# EAGLE design ArduWatch (EAGLE 6.4)
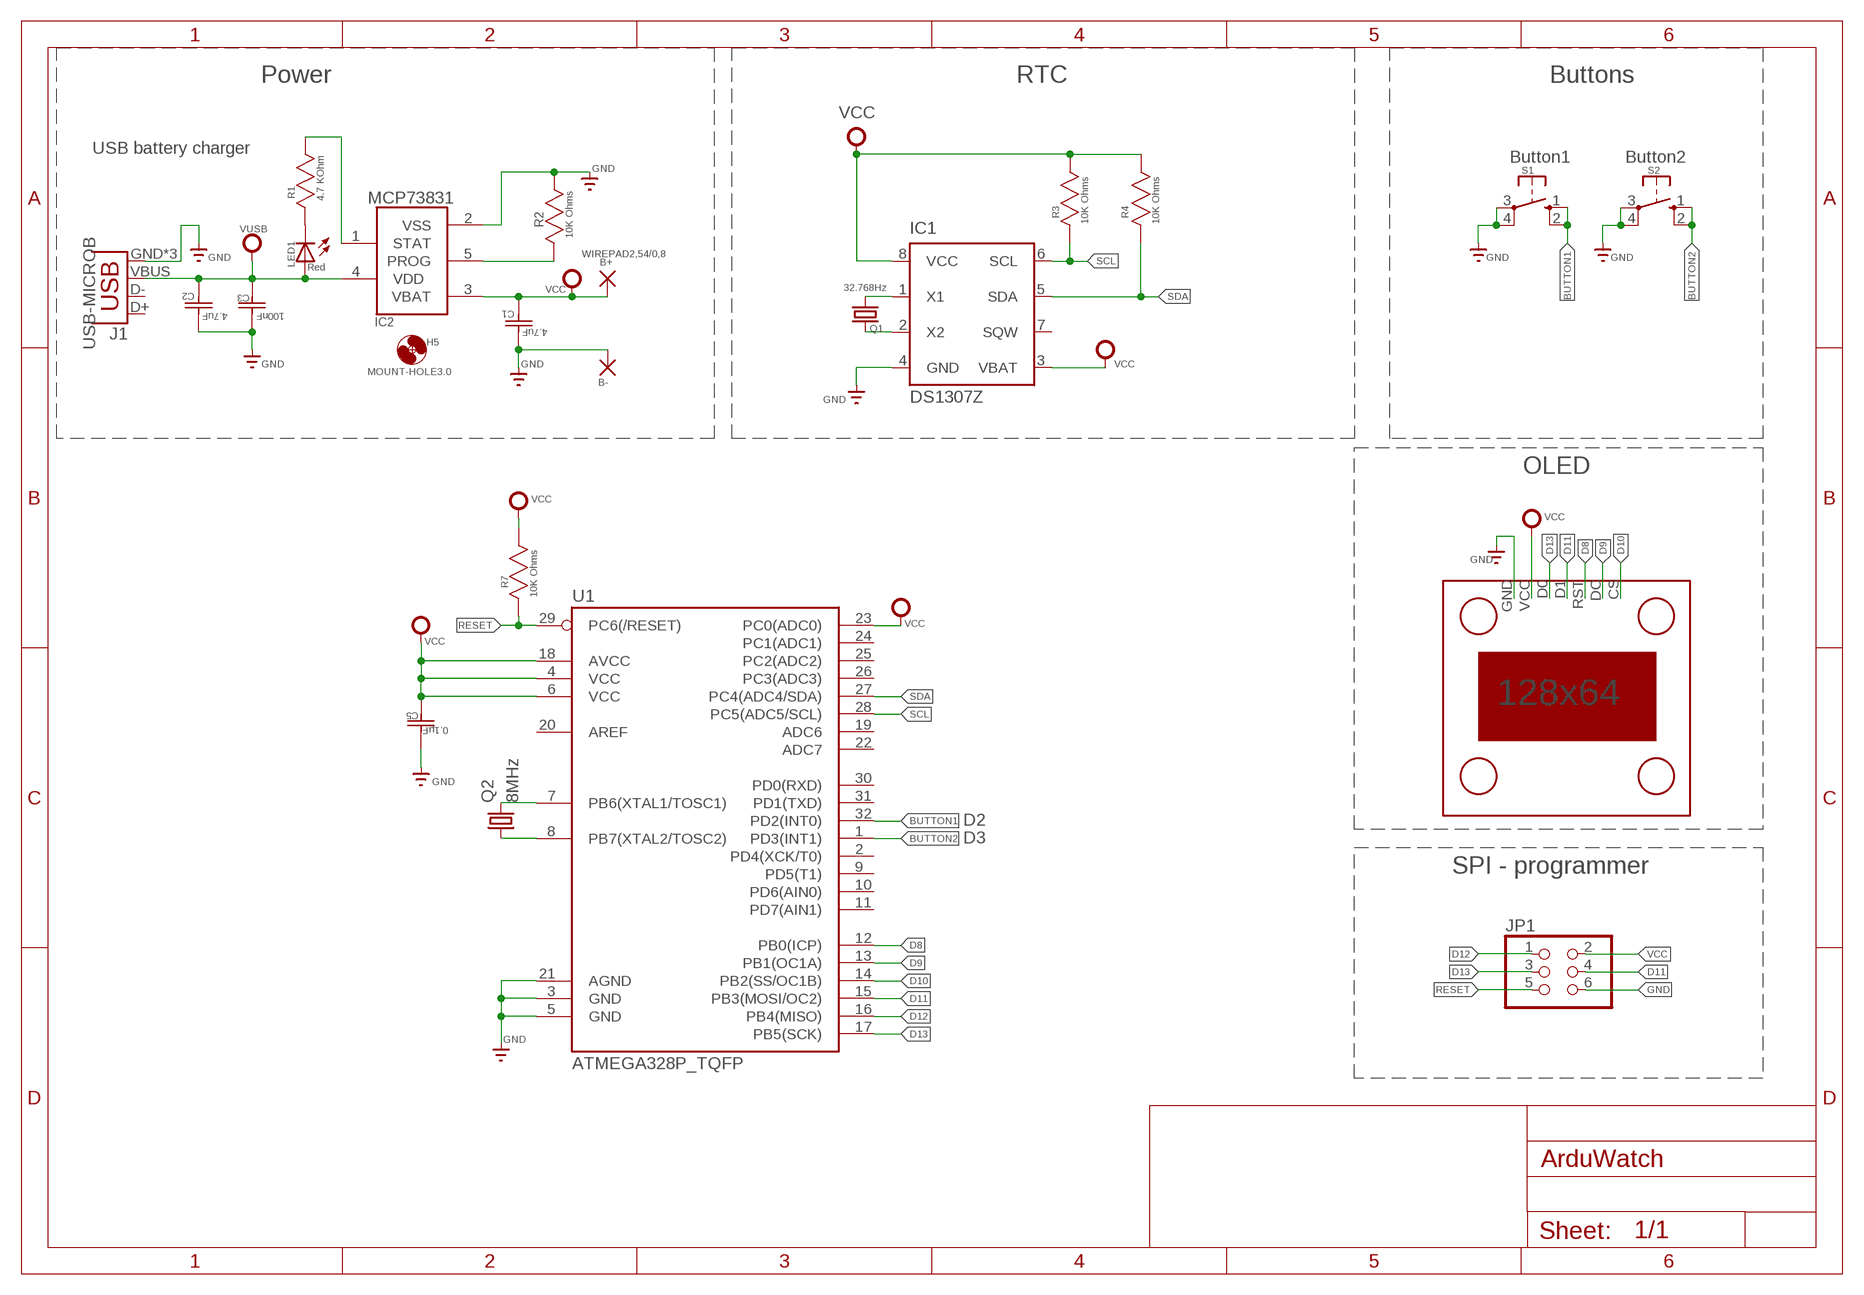
[diagram p0: schematic, sheet 1]

## Parts
1,3"OLED1  OLED  [1,3"OLED]
B+  WIREPAD2,54/0,8  [2,54/0,8]
B-  WIREPAD2,54/0,8  [2,54/0,8]
C1  4.7uF  C1206C475K3RACTU  [CAPC3216X180N]
C2  4.7uF  C1206C475K3RACTU  [CAPC3216X180N]
C3  100nF  C1206C104K1RACTU  [CAPC3216X88N]
C5  0.1µF  1206YC104KAT2A  [CAPC3216X94N]
H5  MOUNT-HOLE3.0  [3,0]
IC1  DS1307Z  [SOIC8]
IC2  MCP73831  [SOT23-5L]
J1  USB-MICROB  [USB-MICROB]
JP1  PINHD-2X3  [2X03]
LED1  Red  LEDCHIPLED_1206  [CHIPLED_1206]
Q1  32.768Hz  CRYSTALTC26H  [TC26H]
Q2  8MHz  CRYSTALHC49S  [HC49/S]
R1  4.7 KOhm  ERJ-8ENF4701V  [RESC3216X71N]
R2  10K Ohms  MC0.125W12061%10K  [RESC3216X71N]
R3  10K Ohms  MC0.125W12061%10K  [RESC3216X71N]
R4  10K Ohms  MC0.125W12061%10K  [RESC3216X71N]
R7  10K Ohms  MC0.125W12061%10K  [RESC3216X71N]
S1  Button1  10-XX  [B3F-10XX]
S2  Button2  10-XX  [B3F-10XX]
U1  ATMEGA328P_TQFP  [TQFP32-08]

## Nets
BUTTON1: S1.1(S) S1.2(S1) U1.32(PD2(INT0))
BUTTON2: S2.1(S) S2.2(S1) U1.1(PD3(INT1))
D8: 1,3"OLED1.RST U1.12(PB0(ICP))
D9: 1,3"OLED1.DC U1.13(PB1(OC1A))
D10: 1,3"OLED1.CS U1.14(PB2(SS/OC1B))
D11: 1,3"OLED1.D1 JP1.4 U1.15(PB3(MOSI/OC2))
D12: JP1.1 U1.16(PB4(MISO))
D13: 1,3"OLED1.D0 JP1.3 U1.17(PB5(SCK))
GND: 1,3"OLED1.GND B-.1(P) C1.1(C1) C2.1(C1) C3.1(C1) C5.1(C1) IC1.4(GND) IC2.2(VSS) J1.GND J1.MT1(GND) J1.MT2(GND) JP1.6 R2.1(R1) S1.3(P) S1.4(P1) S2.3(P) S2.4(P1) U1.3(GND) U1.5(GND) U1.21(AGND)
N$1: LED1.C R1.2(R2)
N$2: IC1.1(X1) Q1.2
N$3: IC2.1(STAT) R1.1(R1)
N$4: IC2.5(PROG) R2.2(R2)
N$5: IC1.2(X2) Q1.1
N$8: Q2.2 U1.7(PB6(XTAL1/TOSC1))
N$9: Q2.1 U1.8(PB7(XTAL2/TOSC2))
RESET: JP1.5 R7.2(R2) U1.29(PC6(/RESET))
SCL: IC1.6(SCL) R3.2(R2) U1.28(PC5(ADC5/SCL))
SDA: IC1.5(SDA) R4.2(R2) U1.27(PC4(ADC4/SDA))
VCC: 1,3"OLED1.VCC B+.1(P) C1.2(C2) C5.2(C2) IC1.3(VBAT) IC1.8(VCC) IC2.3(VBAT) JP1.2 R3.1(R1) R4.1(R1) R7.1(R1) U1.4(VCC) U1.6(VCC) U1.18(AVCC) U1.23(PC0(ADC0))
VUSB: C2.2(C2) C3.2(C2) IC2.4(VDD) J1.VBUS LED1.A
Unconnected: IC1.7(SQW) J1.D+ J1.D- U1.2(PD4(XCK/T0)) U1.9(PD5(T1)) U1.10(PD6(AIN0)) U1.11(PD7(AIN1)) U1.19(ADC6) U1.20(AREF) U1.22(ADC7) U1.24(PC1(ADC1)) U1.25(PC2(ADC2)) U1.26(PC3(ADC3)) U1.30(PD0(RXD)) U1.31(PD1(TXD))

## Notes on the sheet
- Power | RTC | Buttons
- USB battery charger
- OLED
- D2
- D3
- SPI - programmer

## Library data of the parts
1,3"OLED1 = Podreczne:OLED
B+ B- = wirepad:WIREPAD: Wire PAD connect wire on PCB
C1 C2 = Kemet_By_element14_Batch_1:C1206C475K3RACTU: CAPACITOR, 1206; MPN: C1206C475K3RACTU; OC_FARNELL: 1288211; OC_NEWARK: 88K0224; SUPPLIER: Kemet; TOLERANCE: ±10%; VOLTAGERATING: 25V
C3 = Kemet_By_element14_Batch_1:C1206C104K1RACTU: CAPACITOR, 1206; MPN: C1206C104K1RACTU; OC_FARNELL: 1414714; OC_NEWARK: 85C2205; SUPPLIER: Kemet; TOLERANCE: ±10%; VOLTAGERATING: 100V
C5 = AVX_By_element14_Batch_1:1206YC104KAT2A: Capacitor 1206; MPN: 1206YC104KAT2A; OC_FARNELL: 4705907; OC_NEWARK: 34C6813; SUPPLIER: AVX; TOLERANCE: ±10%; VOLTAGERATING: 16V
H5 = holes:MOUNT-HOLE: MOUNTING HOLE with drill center marker
IC1 = ds1307_pcf8583:DS1307: I2C-Bus CLOCK/CALENDAR
IC2 = microchip-update:MCP73831: Miniature Single-Cell, Fully Integrated Li-Ion, Li-Polymer Charge Management Controllers
J1 = SparkFun-Connectors:USB: USB Connectors USB-B-PTH is fully proven SKU : PRT-00139/CONN-08278 USB-miniB is fully proven SKU : PRT-00587 USB-A-PCB is untested. USB-A-H is throughly reviewed, but untested. Spark Fun Electronics SKU : PRT-00437 USB-B-SMT is throughly reviewed, but untested. Needs silkscreen touching up. USB-A-S has not been used/tested USB-MB-H has not been used/tested USB-MICROB has been used. CONN-09505; PROD_ID: CONN-09505
JP1 = pinhead:PINHD-2X3: PIN HEADER
LED1 = adafruit:LED: LED OSRAM: - CHIPLED LG R971, LG N971, LY N971, LG Q971, LY Q971, LO R971, LY R971 LH N974, LH R974 LS Q976, LO Q976, LY Q976 LO Q996 - Hyper CHIPLED LW Q18S LB Q993, LB Q99A, LB R99A - SideLED LS A670, LO A670, LY A670, LG A670, LP A670 LB A673, LV A673, LT A673, LW A673 LH A674 LY A675 LS A676, LA A676, LO A676, LY A676, LW A676 LS A679, LY A679, LG A679 - Hyper Micro SIDELED® LS Y876, LA Y876, LO Y876, LY Y876 LT Y87S - SmartLED LW L88C, LW L88S LB L89C, LB L89S, LG L890 LS L89K, LO L89K, LY L89K LS L896, LA L896, LO L896, LY L896 - TOPLED LS T670, LO T670, LY T670, LG T670, LP T670 LSG T670, LSP T670, LSY T670, LOP T670, LYG T670 LG T671, LOG T671, LSG T671 LB T673, LV T673, LT T673, LW T673 LH T674 LS T676, LA T676, LO T676, LY T676, LB T676, LH T676, LSB T676, LW T676 LB T67C, LV T67C, LT T67C, LS T67K, LO T67K, LY T67K, LW E67C LS E67B, LA E67B, LO E67B, LY E67B, LB E67C, LV E67C, LT E67C LW T67C LS T679, LY T679, LG T679 LS T770, LO T770, LY T770, LG T770, LP T770 LB T773, LV T773, LT T773, LW T773 LH T774 LS E675, LA E675, LY E675, LS T675 LS T776, LA T776, LO T776, LY T776, LB T776 LHGB T686 LT T68C, LB T68C - Hyper Mini TOPLED® LB M676 - Mini TOPLED Santana® LG M470 LS M47K, LO M47K, LY M47K Source: http://www.osram.convergy.de/
Q1 = crystal:CRYSTAL: CRYSTAL; OC_FARNELL: unknown; OC_NEWARK: unknown
Q2 = crystal:CRYSTAL: CRYSTAL; OC_FARNELL: 1667008; OC_NEWARK: unknown
R1 = Panasonic_By_element14_Batch_1:ERJ-8ENF4701V: RESISTOR, 1206; MPN: ERJ-8ENF4701V; OC_FARNELL: 1748442; OC_NEWARK: 64R5471; SUPPLIER: Panasonic; TOLERANCE: ±1 %; WATTAGE: 0.25 W
R2-R4 R7 = Multicomp_By_element14_Batch_1:MC0.125W12061%10K: RESISTOR, 1206; MPN: MC0.125W12061%10K; OC_FARNELL: 9335765; OC_NEWARK: 39K0872; SUPPLIER: Multicomp; TOLERANCE: ±1%; WATTAGE: 1/8 W
S1 S2 = switch-omron:10-XX: OMRON SWITCH; MPN: B3F-1000; OC_FARNELL: 176432; OC_NEWARK: 36M3542
U1 = SparkFun-DigitalIC:ATMEGA328P_TQFP; PROD_ID: IC-09069

## Board
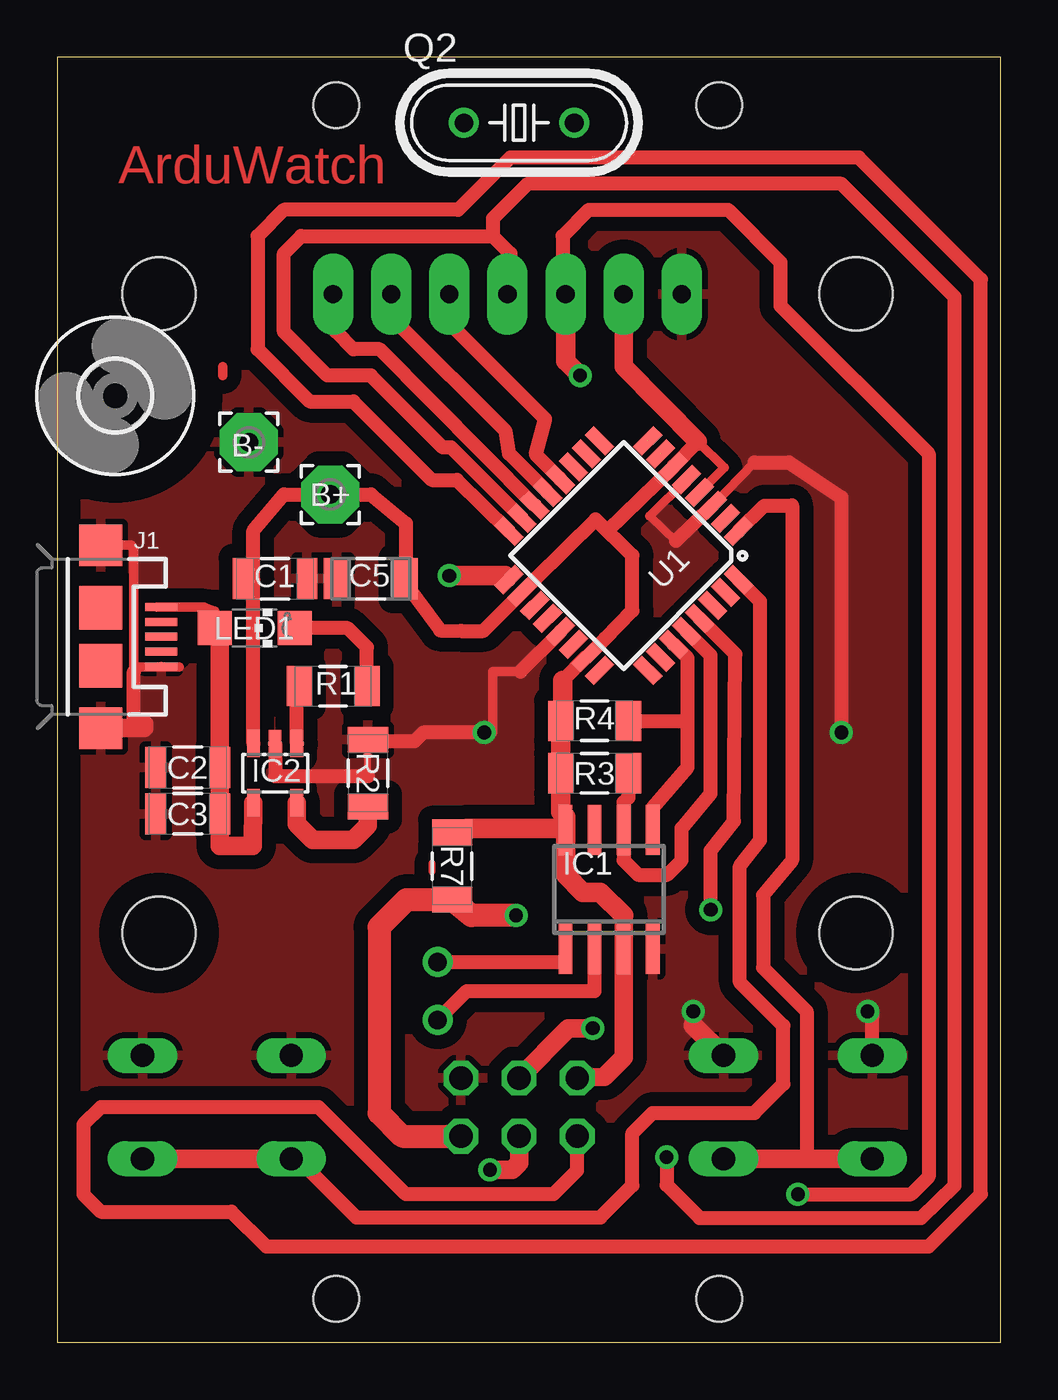
[diagram p1: board, top side]
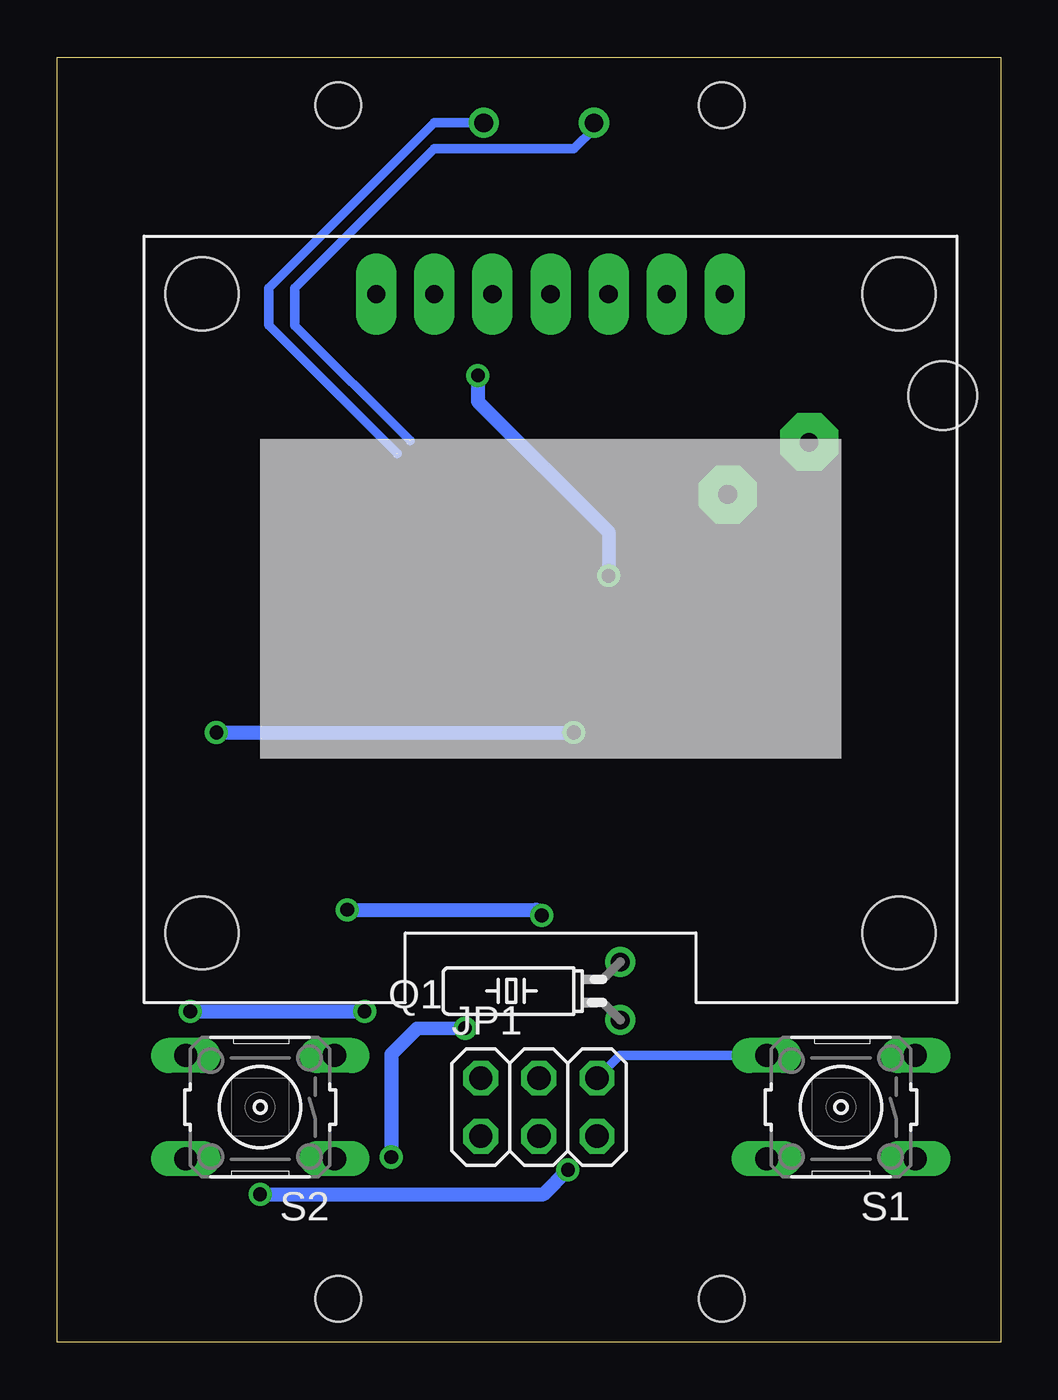
[diagram p2: board, bottom side, seen from below]

Size 41.26 x 56.21 mm. Coordinates in mm from the lower left corner, seen from the top.
Outline: 0,0 41.26,0 41.26,56.21 0,56.21 0,0
Copper layers (1*16): Top 0.035mm / dielectric 1.5mm / Bottom 0.035mm
Design rules "default *": minimum track width 10mil, minimum drill 24mil, track to track 6mil, track to pad 6mil, pad to pad 6mil, via to via 8mil, smd to smd 6mil, copper to edge 40mil, drill to drill 8mil, minimum pad ring 10mil, minimum via ring 8mil, stop-mask expansion 4mil, vias tented up to drill 0mil, thermal gap 10mil
Holes 2 mm at 12.19,1.91 28.96,1.91 12.19,54.1 28.96,54.1

### Footprints (pad centres in the part's own frame; a part is rotated, then mirrored left to right if it is on the bottom)
1,3"OLED = drill 0.8 pad 1.778 long: CS 7.62,12.7; D0 -2.54,12.7; D1 0,12.7; DC 5.08,12.7; GND -7.62,12.7; RST 2.54,12.7; VCC -5.08,12.7 | hole 3.2: -15.24,12.7; 15.24,12.7; 15.24,-15.24; -15.24,-15.24
2,54/0,8 = drill 0.813 pad 2.54 octagon: 1 0,0
CAPC3216X180N = smd 0.914 x 1.803: 1 -1.397,0; 2 1.397,0
CAPC3216X88N = smd 0.914 x 1.803: 1 -1.397,0; 2 1.397,0
CAPC3216X94N = smd 1.118 x 1.803: 1 -1.499,0; 2 1.499,0
3,0 = hole 3: 0,0
SOIC8 = smd 0.6 x 2.2: 1 -1.905,-2.6; 2 -0.635,-2.6; 3 0.635,-2.6; 4 1.905,-2.6; 5 1.905,2.6; 6 0.635,2.6; 7 -0.635,2.6; 8 -1.905,2.6
SOT23-5L = smd 0.55 x 1.2: 1 -0.95,-1.3; 2 0,-1.3; 3 0.95,-1.3; 4 0.95,1.3; 5 -0.95,1.3
USB-MICROB = smd 0.35 x 1.4: D+ 0,2.65; D- -0.65,2.65; GND 1.3,2.65; ID 0.65,2.65; VBUS -1.3,2.65 | smd 1.8 x 1.9: MT1 -4,0; MT2 4,0 | smd 1.9 x 1.9: P$1 -1.27,0; P$2 1.27,0
2X03 = drill 1.016 octagon: 1 -2.54,-1.27; 2 -2.54,1.27; 3 0,-1.27; 4 0,1.27; 5 2.54,-1.27; 6 2.54,1.27
CHIPLED_1206 = smd 1.5 x 1.5: A 0,-1.75; C 0,1.75
TC26H = drill 0.813: 1 -1.27,0; 2 1.27,0
HC49/S = drill 0.813: 1 -2.413,0; 2 2.413,0
RESC3216X71N = smd 1.118 x 1.753: 1 -1.473,0; 2 1.473,0
B3F-10XX = drill 1.016 long: 1 -3.251,2.261; 2 3.251,2.261; 3 -3.251,-2.261; 4 3.251,-2.261
TQFP32-08 = smd 1.27 x 0.559: 1 -4.293,2.8; 2 -4.293,2; 3 -4.293,1.2; 4 -4.293,0.4; 5 -4.293,-0.4; 6 -4.293,-1.2; 7 -4.293,-2; 8 -4.293,-2.8; 17 4.293,-2.8; 18 4.293,-2; 19 4.293,-1.2; 20 4.293,-0.4; 21 4.293,0.4; 22 4.293,1.2; 23 4.293,2; 24 4.293,2.8 | smd 0.559 x 1.27: 9 -2.8,-4.293; 10 -2,-4.293; 11 -1.2,-4.293; 12 -0.4,-4.293; 13 0.4,-4.293; 14 1.2,-4.293; 15 2,-4.293; 16 2.8,-4.293; 25 2.8,4.293; 26 2,4.293; 27 1.2,4.293; 28 0.4,4.293; 29 -0.4,4.293; 30 -1.2,4.293; 31 -2,4.293; 32 -2.8,4.293

### Placement (x,y rotation side)
1,3"OLED1  19.68,33.15 0 bottom
B+  11.94,37.08 0 top
B-  8.38,39.37 0 top
C1  9.53,33.4 180 top
C2  5.71,25.15 0 top
C3  5.71,23.11 0 top
C5  13.72,33.4 0 top
DRILEGEND  [DRILEGEND]  52.25,45.01 0 top  (outside the outline)
H5  2.54,41.4 0 top
IC1  24.13,19.81 0 top
IC2  9.53,24.89 180 top
J1  1.91,30.86 270 top
JP1  20.19,10.29 0 bottom
LED1  8.64,31.24 270 top
Q1  16.64,15.37 90 bottom
Q2  20.19,53.34 0 top
R1  12.06,28.7 0 top
R2  13.59,24.89 270 top
R3  23.5,24.89 0 top
R4  23.5,27.18 0 top
R7  17.27,20.83 270 top
S1  6.99,10.29 180 bottom
S2  32.38,10.29 180 bottom
U1  24.77,34.42 225 top

### Tracks (layer width: path | path; a pad name or v marks a point on that pad's centre or on a via)
BUTTON1
  Top 0.61: S1.2 10.52,8.03 13.08,5.46 23.75,5.46 25.15,6.86 25.15,9.14 26.04,10.03 30.48,10.03 31.75,11.3 31.75,13.84 29.84,15.75 29.84,20.83 30.73,21.97 30.73,32.41 U1.32
  Top 0.813: S1.1 S1.2
BUTTON2
  Top 0.61: U1.1 30.92,36.59 32.13,36.6 32.13,21.08 30.86,19.56 30.86,16.38 32.77,14.48 32.77,8.03
  Top 0.813: S2.2 32.77,8.03 S2.1
D8
  Top 0.61: U1.12 21.99,37.75 21.96,37.8 20.93,38.84 21.34,40.39 17.14,44.58
  Top 0.813: 17.14,44.58 1,3"OLED1.RST
D9
  Top 0.61: U1.13 21.42,37.2 19.76,38.86 19.61,39.85 14.86,44.58 14.86,45.59 1,3"OLED1.DC
D10
  Top 0.61: U1.14 14.1,43.43 12.95,43.43 12.19,44.2 12.19,45.72 1,3"OLED1.CS
D11  (via drill 0.6)
  Top 0.61: U1.15 20.29,36.07 17.22,39.14 16.87,39.14 13.72,42.29 11.81,42.29 9.91,44.2 9.91,47.62 10.67,48.39 19.05,48.39 | 19.05,48.39 19.81,47.62 19.81,45.97 1,3"OLED1.D1 | v26.64,8.1 26.64,6.88 28.09,5.44 37.77,5.44 39.24,6.86 39.24,45.72 34.29,50.67 20.57,50.67 19.05,49.15 19.05,48.39
  Top 0.813: v23.42,13.74 22.35,13.74 JP1.4
  Bottom 0.61: v23.42,13.74 25.53,13.72 26.64,12.6 v26.64,8.1
D12
  Top 0.61: U1.16 17.48,37.72 16.38,37.72 12.95,41.15 11.05,41.15 8.76,43.43 8.76,48.39 9.91,49.53 17.53,49.53 19.81,51.82 35.05,51.82 40.39,46.48 40.39,6.48 38.1,4.19 9.14,4.19 7.62,5.71 1.91,5.71 1.14,6.48 1.14,9.53 1.91,10.29 11.43,10.29 15.24,6.48 21.69,6.48 22.73,7.52 JP1.1
D13  (via drill 0.6)
  Top 0.61: v32.38,6.48 37.34,6.48 38.1,7.24 38.1,38.86 31.62,45.34 31.62,47.24 29.34,49.53 23.24,49.53 22.1,48.39 22.1,45.97 1,3"OLED1.D0 | 19.58,33.53 U1.17
  Top 0.813: v18.92,7.54 19.89,7.54 20.19,7.85 JP1.3
  Top 0.85: 1,3"OLED1.D0 22.23,42.93 v22.86,42.29 | v17.14,33.53 19.58,33.53
  Bottom 0.61: v22.86,42.29 22.86,41.15 17.14,35.43 v17.14,33.53 | v32.38,6.48 19.99,6.48 v18.92,7.54
GND  (via drill 0.6)
  Top 0.305: 3.81,27.05 3.35,27.05 | 13.59,24.77 R2.1
  Top 0.358: 25.91,36.14 27.05,35.05
  Top 0.406: U1.3 28.67,36.62 30.48,38.48 | U1.5 25.91,36.14 | J1.MT1 3.24,34.86 3.35,34.67 3.35,29.54 | 3.35,29.34 3.35,29.54 | 3.35,29.54 4.57,29.54 5.33,29.54 J1.GND | v18.67,26.67 19.05,26.67 19.05,29.34 20.25,29.34
  Top 0.61: S2.4 35.64,14.28 v35.43,14.48 | v27.81,14.48 27.81,13.87 | 30.48,38.48 32,38.48 34.29,36.96 v34.29,26.67 | v18.67,26.67 16,26.67 15.62,26.29 14.05,26.29 R2.1 | 27.05,35.05 U1.3 | 20.25,29.34 U1.21 | 3.35,27.05 3.35,29.34 | IC2.2 9.53,24.77 13.59,24.77
  Top 0.813: J1.MT2 3.81,26.86 3.81,27.05
  Top 0.85: 27.81,13.87 S2.3
  Bottom 0.406: S1.4 16.66,12.55 JP1.6
  Bottom 0.61: v35.43,14.48 v27.81,14.48 | v34.29,26.67 v18.67,26.67
  pour Top (isolate 0.61): -4.32,58.42 48.64,58.42 48.26,-1.65 -4.32,-1.65
N$1
  Top 0.61: R1.2 13.54,30.4 12.7,31.24 LED1.C
N$2
  Top 0.61: Q1.2 22.23,16.64 IC1.1
N$3
  Top 0.61: IC2.1 10.47,28.59 R1.1
N$4
  Top 0.813: IC2.5 10.47,22.67 11.18,21.97 12.95,21.97 13.59,22.61 R2.2
N$5
  Top 0.61: Q1.1 17.91,15.37 23.5,15.37 IC1.2
N$6
  Top 0.305: 16.38,20.95 16.38,20.57
N$7
  Top 0.406: 7.24,42.29 7.24,42.67
N$8  (1 unrouted)
  Bottom 0.406: Q2.2 24.77,53.34 32,46.1 32,44.48 U1.7
N$9  (1 unrouted)
  Bottom 0.406: Q2.1 17.78,53.09 18.67,52.2 24.77,52.2 30.86,46.1 30.86,44.47 U1.8
RESET  (via drill 0.6)
  Top 0.61: v28.57,18.92 28.57,21.51 29.59,22.78 29.65,30.1 U1.29
  Top 1.016: v20.07,18.67 18.11,18.67 R7.2 15.27,19.36 14.07,18.16 14.07,10.03 15.09,9.02 JP1.5
  Bottom 0.61: v28.57,18.92 20.32,18.92 v20.07,18.67
SCL
  Top 0.61: U1.28 28.57,30.04 28.57,24 27.3,22.48 27.3,21.08 26.67,20.45 25.4,20.45 24.77,21.08 IC1.6 24.77,23.62 24.97,23.82 R3.2
SDA
  Top 0.61: IC1.5 26.04,23.37 27.56,25.15 27.56,27.18 | 27.56,27.18 27.56,29.93 U1.27 | R4.2 27.56,27.18
VCC
  Top 0.406: U1.4 28.1,37.2 29.16,38.25 28.02,39.4
  Top 0.61: IC2.3 8.57,33.34 | 8.57,33.34 C1.2 | 8.57,33.34 8.57,35.5 9.91,37.08 B+.1 13.72,37.08 15.24,35.81 15.24,33.17 16.74,31.14 17.65,31.11 18.64,31.11 U1.18 20.91,33.38 23.55,35.99 | 23.55,35.99 24.06,35.48 U1.6 26.95,38.33 28.02,39.4 | 23.55,35.99 25.15,34.42 25.15,32 23.96,30.79 U1.23 23.11,29.97 22.1,28.96 | 22.1,26.87 R4.1 | 22.02,23.19 22.23,22.99 | 22.16,22.48 IC1.8
  Top 0.813: 28.02,39.4 24.77,42.67 1,3"OLED1.VCC | 15.24,33.17 C5.2 | 24.77,18.67 IC1.3 24.77,12.47 23.93,11.61 JP1.2
  Top 0.85: 22.1,28.96 22.1,26.87 | R4.1 R3.1 22.02,23.19 | 22.23,22.99 IC1.8 22.23,20.45 22.99,19.68 23.75,19.68 24.77,18.67 | R7.1 17.27,22.23 17.91,22.48 22.16,22.48
VUSB
  Top 0.406: LED1.A 6.89,31.98 6.43,32.16 4.35,32.16 J1.VBUS
  Top 0.813: IC2.4 8.54,21.72 7.11,21.72 C3.2 C2.2 7.11,31.11 7.01,31.11 LED1.A

### Text on the board
Top: ArduWatch